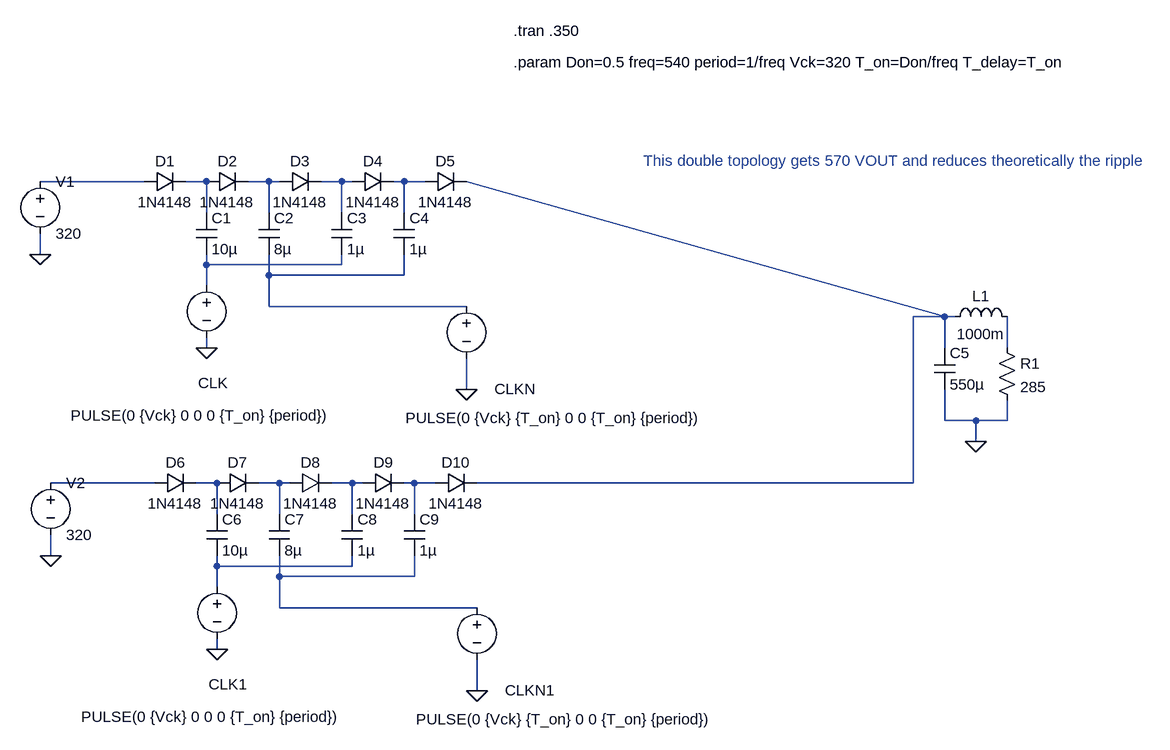
[diagram p0: schematic Double_cp_2_2024_03_19.asc]
Double_cp_2_2024_03_19.asc, the LTspice schematic file:
Version 4
SHEET 1 1908 876
WIRE 128 32 -32 32
WIRE 224 32 192 32
WIRE 320 32 288 32
WIRE 336 32 320 32
WIRE 432 32 400 32
WIRE 448 32 432 32
WIRE 528 32 512 32
WIRE 560 32 528 32
WIRE 224 80 224 32
WIRE 320 80 320 32
WIRE 432 80 432 32
WIRE 528 80 528 32
WIRE -32 144 -32 112
WIRE 224 160 224 144
WIRE 432 160 432 144
WIRE 432 160 224 160
WIRE 320 176 320 144
WIRE 528 176 528 144
WIRE 528 176 320 176
WIRE 224 192 224 160
WIRE 320 224 320 176
WIRE 624 224 320 224
WIRE 1360 240 624 32
WIRE 1360 240 1312 240
WIRE 1376 240 1360 240
WIRE 224 288 224 272
WIRE 1360 288 1360 240
WIRE 1456 288 1456 240
WIRE 624 352 624 304
WIRE 1360 400 1360 352
WIRE 1408 400 1360 400
WIRE 1456 400 1456 368
WIRE 1456 400 1408 400
WIRE 1408 432 1408 400
WIRE 144 496 -16 496
WIRE 240 496 208 496
WIRE 336 496 304 496
WIRE 352 496 336 496
WIRE 448 496 416 496
WIRE 464 496 448 496
WIRE 544 496 528 496
WIRE 576 496 544 496
WIRE 1312 496 1312 240
WIRE 1312 496 640 496
WIRE 240 544 240 496
WIRE 336 544 336 496
WIRE 448 544 448 496
WIRE 544 544 544 496
WIRE -16 608 -16 576
WIRE 240 624 240 608
WIRE 448 624 448 608
WIRE 448 624 240 624
WIRE 336 640 336 608
WIRE 544 640 544 608
WIRE 544 640 336 640
WIRE 240 656 240 624
WIRE 336 688 336 640
WIRE 640 688 336 688
WIRE 240 752 240 736
WIRE 640 816 640 768
FLAG 1408 432 0
FLAG -32 144 0
FLAG 224 288 0
FLAG 624 352 0
FLAG -16 608 0
FLAG 240 752 0
FLAG 640 816 0
SYMBOL voltage -32 16 R0
WINDOW 123 0 0 Left 0
WINDOW 39 0 0 Left 0
SYMATTR InstName V1
SYMATTR Value 320
SYMBOL voltage 224 176 R0
WINDOW 123 0 0 Left 0
WINDOW 39 0 0 Left 0
WINDOW 0 -13 166 Left 2
WINDOW 3 -209 216 Left 2
SYMATTR InstName CLK
SYMATTR Value PULSE(0 {Vck} 0 0 0 {T_on} {period})
SYMBOL voltage 624 208 R0
WINDOW 123 0 0 Left 0
WINDOW 39 0 0 Left 0
WINDOW 0 43 143 Left 2
WINDOW 3 -94 188 Left 2
SYMATTR InstName CLKN
SYMATTR Value PULSE(0 {Vck} {T_on} 0 0 {T_on} {period})
SYMBOL diode 128 48 R270
WINDOW 0 32 32 VTop 2
WINDOW 3 0 32 VBottom 2
SYMATTR InstName D1
SYMATTR Value 1N4148
SYMBOL diode 224 48 R270
WINDOW 0 32 32 VTop 2
WINDOW 3 0 32 VBottom 2
SYMATTR InstName D2
SYMATTR Value 1N4148
SYMBOL diode 336 48 R270
WINDOW 0 32 32 VTop 2
WINDOW 3 0 32 VBottom 2
SYMATTR InstName D3
SYMATTR Value 1N4148
SYMBOL diode 448 48 R270
WINDOW 0 32 32 VTop 2
WINDOW 3 0 32 VBottom 2
SYMATTR InstName D4
SYMATTR Value 1N4148
SYMBOL diode 560 48 R270
WINDOW 0 32 32 VTop 2
WINDOW 3 0 32 VBottom 2
SYMATTR InstName D5
SYMATTR Value 1N4148
SYMBOL cap 208 80 R0
SYMATTR InstName C1
SYMATTR Value 10µ
SYMBOL cap 304 80 R0
SYMATTR InstName C2
SYMATTR Value 8µ
SYMBOL cap 416 80 R0
SYMATTR InstName C3
SYMATTR Value 1µ
SYMBOL cap 512 80 R0
SYMATTR InstName C4
SYMATTR Value 1µ
SYMBOL cap 1344 288 R0
SYMATTR InstName C5
SYMATTR Value 550µ
SYMBOL res 1440 272 R0
SYMATTR InstName R1
SYMATTR Value 285
SYMBOL ind 1360 256 R270
WINDOW 0 32 56 VTop 2
WINDOW 3 5 56 VBottom 2
SYMATTR InstName L1
SYMATTR Value 1000m
SYMBOL voltage -16 480 R0
WINDOW 123 0 0 Left 0
WINDOW 39 0 0 Left 0
SYMATTR InstName V2
SYMATTR Value 320
SYMBOL voltage 240 640 R0
WINDOW 123 0 0 Left 0
WINDOW 39 0 0 Left 0
WINDOW 0 -13 166 Left 2
WINDOW 3 -209 216 Left 2
SYMATTR InstName CLK1
SYMATTR Value PULSE(0 {Vck} 0 0 0 {T_on} {period})
SYMBOL voltage 640 672 R0
WINDOW 123 0 0 Left 0
WINDOW 39 0 0 Left 0
WINDOW 0 43 143 Left 2
WINDOW 3 -94 188 Left 2
SYMATTR InstName CLKN1
SYMATTR Value PULSE(0 {Vck} {T_on} 0 0 {T_on} {period})
SYMBOL diode 144 512 R270
WINDOW 0 32 32 VTop 2
WINDOW 3 0 32 VBottom 2
SYMATTR InstName D6
SYMATTR Value 1N4148
SYMBOL diode 240 512 R270
WINDOW 0 32 32 VTop 2
WINDOW 3 0 32 VBottom 2
SYMATTR InstName D7
SYMATTR Value 1N4148
SYMBOL diode 352 512 R270
WINDOW 0 32 32 VTop 2
WINDOW 3 0 32 VBottom 2
SYMATTR InstName D8
SYMATTR Value 1N4148
SYMBOL diode 464 512 R270
WINDOW 0 32 32 VTop 2
WINDOW 3 0 32 VBottom 2
SYMATTR InstName D9
SYMATTR Value 1N4148
SYMBOL diode 576 512 R270
WINDOW 0 32 32 VTop 2
WINDOW 3 0 32 VBottom 2
SYMATTR InstName D10
SYMATTR Value 1N4148
SYMBOL cap 224 544 R0
SYMATTR InstName C6
SYMATTR Value 10µ
SYMBOL cap 320 544 R0
SYMATTR InstName C7
SYMATTR Value 8µ
SYMBOL cap 432 544 R0
SYMATTR InstName C8
SYMATTR Value 1µ
SYMBOL cap 528 544 R0
SYMATTR InstName C9
SYMATTR Value 1µ
TEXT 696 -152 Left 2 !.param Don=0.5 freq=540 period=1/freq Vck=320 T_on=Don/freq T_delay=T_on
TEXT 696 -200 Left 2 !.tran .350
TEXT 896 0 Left 2 ;This double topology gets 570 VOUT and reduces theoretically the ripple

The netlist it stands for:
* Double_cp_2_2024_03_19.asc
V1 N001 0 320
V§CLK N006 0 PULSE(0 {Vck} 0 0 0 {T_on} {period})
V§CLKN N007 0 PULSE(0 {Vck} {T_on} 0 0 {T_on} {period})
D1 N001 N002 1N4148
D2 N002 N003 1N4148
D3 N003 N004 1N4148
D4 N004 N005 1N4148
D5 N005 N008 1N4148
C1 N002 N006 10µ
C2 N003 N007 8µ
C3 N004 N006 1µ
C4 N005 N007 1µ
C5 N008 0 550µ
R1 N009 0 285
L1 N008 N009 1000m
V2 N010 0 320
V§CLK1 N015 0 PULSE(0 {Vck} 0 0 0 {T_on} {period})
V§CLKN1 N016 0 PULSE(0 {Vck} {T_on} 0 0 {T_on} {period})
D6 N010 N011 1N4148
D7 N011 N012 1N4148
D8 N012 N013 1N4148
D9 N013 N014 1N4148
D10 N014 N008 1N4148
C6 N011 N015 10µ
C7 N012 N016 8µ
C8 N013 N015 1µ
C9 N014 N016 1µ
.model D D
.lib standard.dio
.param Don=0.5 freq=540 period=1/freq Vck=320 T_on=Don/freq T_delay=T_on
.tran .350
* This double topology gets 570 VOUT and reduces theoretically the ripple
.backanno
.end